# EAGLE design isolator (EAGLE 5.11)
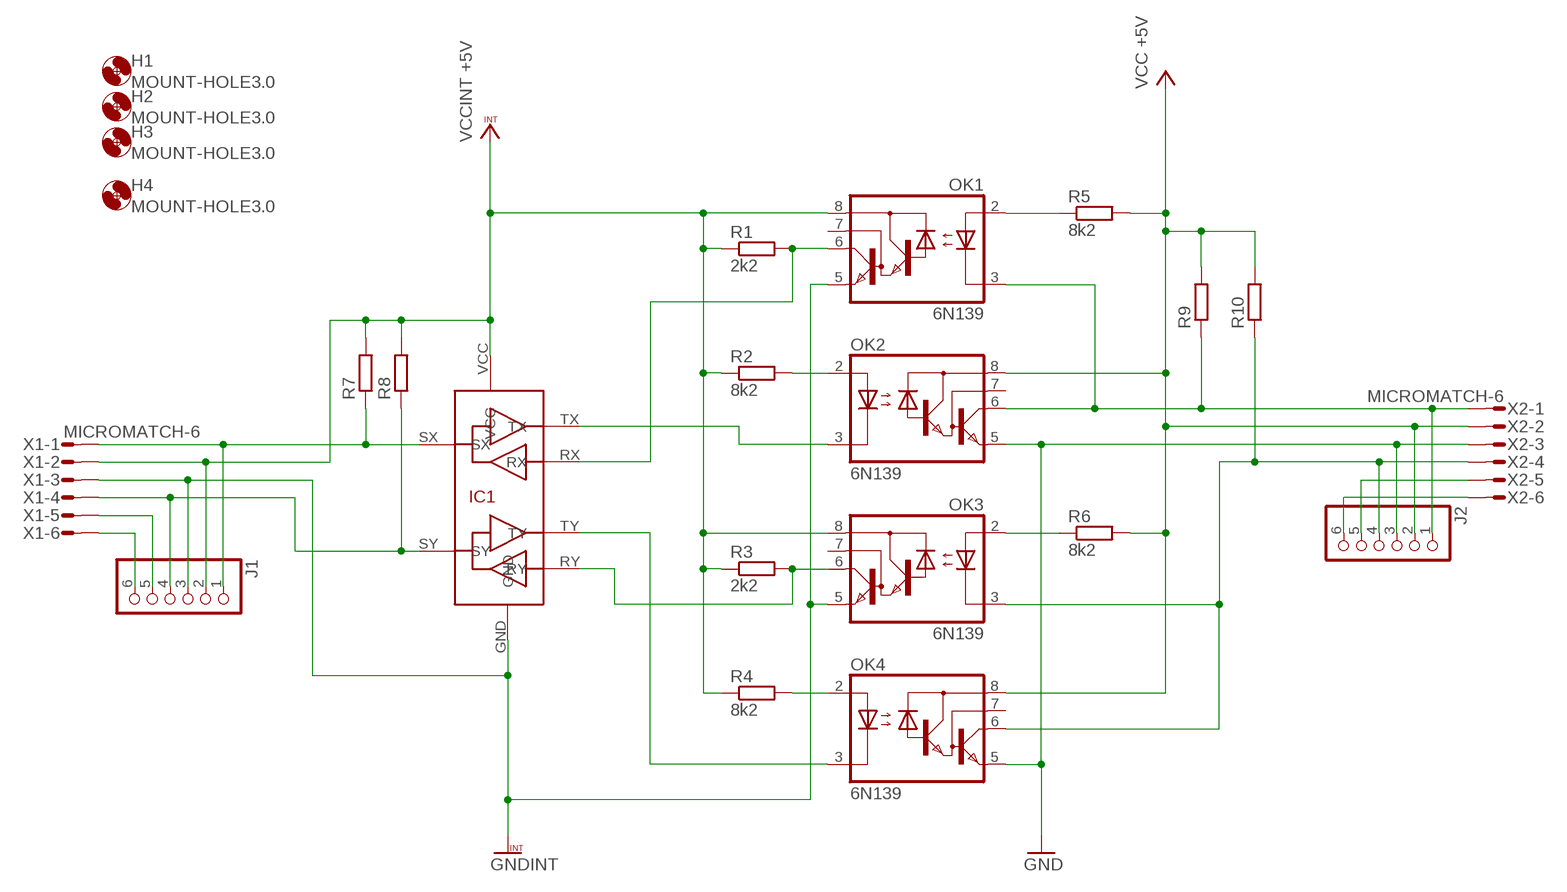
[diagram p0: schematic, sheet 1]

## Parts
H1  MOUNT-HOLE3.0  [3,0]
H2  MOUNT-HOLE3.0  [3,0]
H3  MOUNT-HOLE3.0  [3,0]
H4  MOUNT-HOLE3.0  [3,0]
IC1  P82B96  [DIL08]
J1  PINHD-1X6  [1X06]
J2  PINHD-1X6  [1X06]
OK1  6N139  [DIL08]
OK2  6N139  [DIL08]
OK3  6N139  [DIL08]
OK4  6N139  [DIL08]
R1  2k2  R-EU_0207/10  [0207/10]
R2  8k2  R-EU_0207/10  [0207/10]
R3  2k2  R-EU_0207/10  [0207/10]
R4  8k2  R-EU_0207/10  [0207/10]
R5  8k2  R-EU_0207/10  [0207/10]
R6  8k2  R-EU_0207/10  [0207/10]
R7  R-EU_0207/10  [0207/10]
R8  R-EU_0207/10  [0207/10]
R9  R-EU_0207/10  [0207/10]
R10  R-EU_0207/10  [0207/10]
X1  MICROMATCH-6  [MICROMATCH-6]
X2  MICROMATCH-6  [MICROMATCH-6]

## Nets
GND-EXT: J2.3 OK2.5(GND) OK4.5(GND) X2.3 ; supply symbol labelled GND
GND-INT: IC1.GND J1.3 OK1.5(GND) OK3.5(GND) X1.3 ; supply symbol labelled GNDINT
N$3: OK4.2(A) R4.2
N$5: OK2.2(A) R2.2
N$8: OK1.2(A) R5.1
N$9: OK3.2(A) R6.1
P1-EXT: J2.5 X2.5
P1-INT: J1.5 X1.5
P2-EXT: J2.6 X2.6
P2-INT: J1.6 X1.6
RX: IC1.RX OK1.6(VO) R1.2
RY: IC1.RY OK3.6(VO) R3.2
SCL-EXT: J2.4 OK3.3(C) OK4.6(VO) R10.1 X2.4
SCL-INT: IC1.SY J1.4 R8.1 X1.4
SDA-EXT: J2.1 OK1.3(C) OK2.6(VO) R9.1 X2.1
SDA-INT: IC1.SX J1.1 R7.1 X1.1
TX: IC1.TX OK2.3(C)
TY: IC1.TY OK4.3(C)
VCC-EXT: J2.2 OK2.8(VCC) OK4.8(VCC) R5.2 R6.2 R9.2 R10.2 X2.2 ; supply symbol labelled VCC +5V
VCC-INT: IC1.VCC J1.2 OK1.8(VCC) OK3.8(VCC) R1.1 R2.1 R3.1 R4.1 R7.2 R8.2 X1.2 ; supply symbol labelled VCCINT +5V
Unconnected: OK1.7(VB) OK2.7(VB) OK3.7(VB) OK4.7(VB)

## Library data of the parts
H1-H4 = holes:MOUNT-HOLE: MOUNTING HOLE with drill center marker
IC1 = scratch:P82B96: Dual In Line / Socket
J1 J2 = pinhead:PINHD-1X6: PIN HEADER
OK1-OK4 = optocoupler2:6N139: MOTOROLA OPTO COUPLER; MF: VISHAY/TELEFUNKEN; MPN: 6N138; OC_FARNELL: 9860150; OC_NEWARK: 35K5294
R1-R10 = resistor:R-EU_: RESISTOR, European symbol
X1 X2 = con-amp-micromatch:MICROMATCH-6: MicroMaTch 6 7-215464-6 / 0-215464-6 Drawing Number C-215464 DDEController.pdf; MPN: 7-215464-6; OC_FARNELL: 3784630; OC_NEWARK: 19R8125

## Board
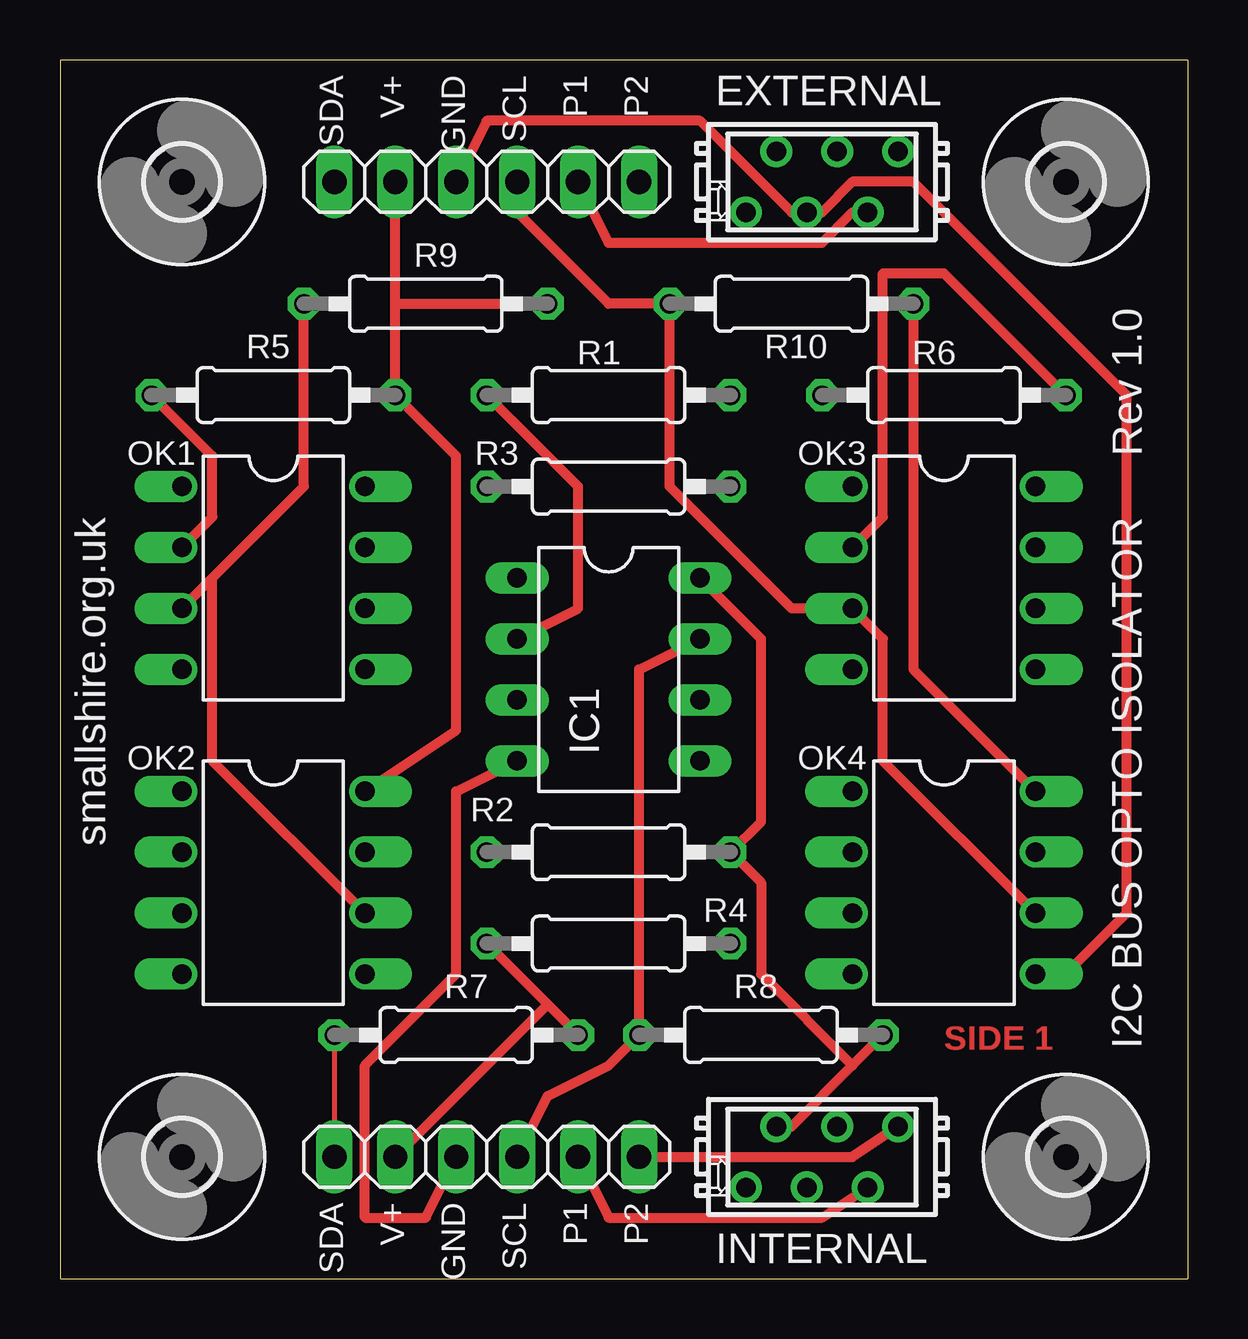
[diagram p1: board, top side]
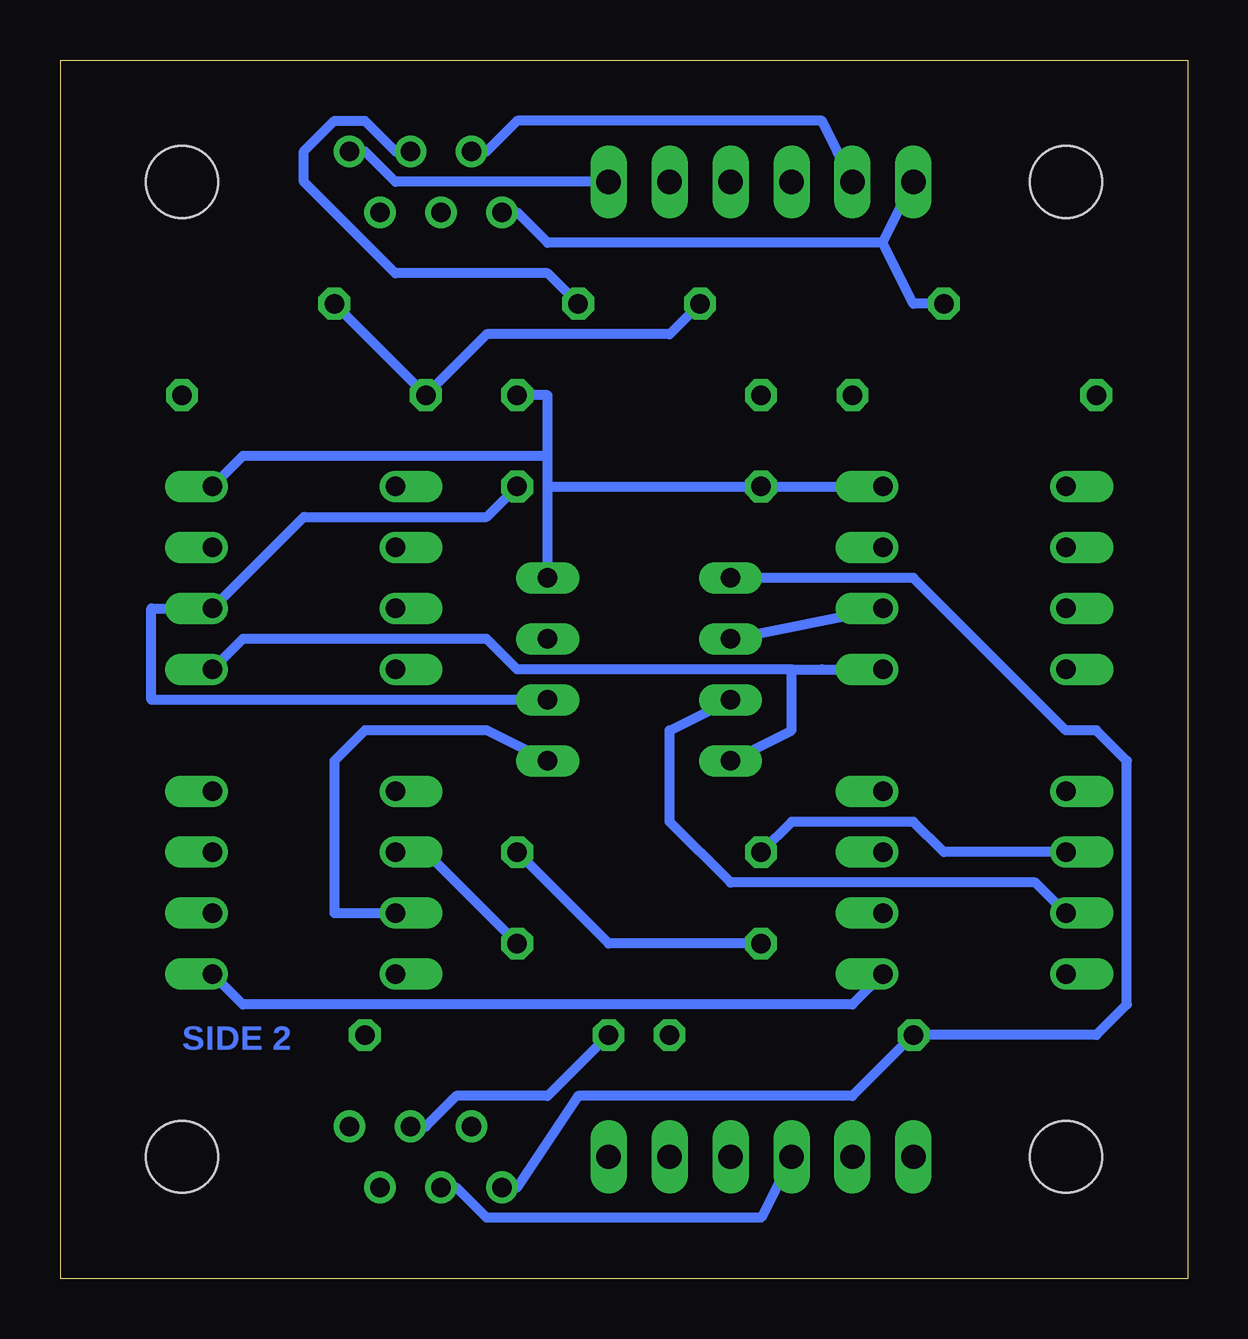
[diagram p2: board, bottom side, seen from below]

Size 46.99 x 50.8 mm. Coordinates in mm from the lower left corner, seen from the top.
Outline: 0,0 46.99,0 46.99,50.8 0,50.79 0,0
Copper layers 1*16: Top 0.035mm / dielectric 1.5mm / Bottom 0.035mm
Design rules "pcbtrain *": minimum track width 0.2mm, minimum drill 0.4mm, track to track 0.2mm, track to pad 0.2mm, pad to pad 0.2mm, via to via 0.2mm, smd to smd 0mil, copper to edge 10mil, drill to drill 0.2mm, minimum pad ring 10mil, minimum via ring 10mil, stop-mask expansion 0.125mm, vias tented up to drill 0mil, thermal gap 10mil

### Footprints (pad centres in the part's own frame; a part is rotated, then mirrored left to right if it is on the bottom)
3,0 = hole 3: 0,0
DIL08 = drill 0.813 long: GND 3.81,-3.81; RX -1.27,-3.81; RY 1.27,3.81; SX -3.81,-3.81; SY -1.27,3.81; TX 1.27,-3.81; TY 3.81,3.81; VCC -3.81,3.81
1X06 = drill 1.016 long: 1 -6.35,0; 2 -3.81,0; 3 -1.27,0; 4 1.27,0; 5 3.81,0; 6 6.35,0
DIL08' = drill 0.813 offset: 1 -3.81,-3.81; 2 -1.27,-3.81; 3 1.27,-3.81; 4 3.81,-3.81; 5 3.81,3.81; 6 1.27,3.81; 7 -1.27,3.81; 8 -3.81,3.81
0207/10 = drill 0.813 octagon: 1 -5.08,0; 2 5.08,0
MICROMATCH-6 = drill 0.813 round: 1 3.175,1.27; 2 1.905,-1.27; 3 0.635,1.27; 4 -0.635,-1.27; 5 -1.905,1.27; 6 -3.175,-1.27

### Placement (x,y rotation side)
H1  5.08,5.08 0 top
H2  5.08,45.72 0 top
H3  41.91,5.08 0 top
H4  41.91,45.72 0 top
IC1  22.86,25.4 270 top
J1  17.78,5.08 0 top
J2  17.78,45.72 0 top
OK1  6N139  [DIL08']  8.89,29.21 270 top
OK2  6N139  [DIL08']  8.89,16.51 270 top
OK3  6N139  [DIL08']  36.83,29.21 270 top
OK4  6N139  [DIL08']  36.83,16.51 270 top
R1  22.86,36.83 180 top
R2  22.86,17.78 180 top
R3  22.86,33.02 0 top
R4  22.86,13.97 0 top
R5  8.89,36.83 0 top
R6  36.83,36.83 180 top
R7  16.51,10.16 0 top
R8  29.21,10.16 0 top
R9  15.24,40.64 0 top
R10  30.48,40.64 0 top
X1  31.75,5.08 180 top
X2  31.75,45.72 180 top

### Tracks (layer width: path | path; a pad name or v marks a point on that pad's centre or on a via)
GND-EXT
  Top 0.406: J2.3 17.78,48.26 26.67,48.26 30.48,44.45 X2.3 31.75,44.45 33.02,45.72 35.56,45.72 44.45,36.83 44.45,15.24 41.91,12.7 OK4.5
  Bottom 0.406: OK2.5 13.97,11.43 39.37,11.43 OK4.5
GND-INT
  Top 0.406: J1.3 15.24,2.54 12.7,2.54 12.7,8.89 16.51,12.7 16.51,20.32 IC1.GND
  Bottom 0.406: J1.3 17.78,2.54 29.21,2.54 30.48,3.81 X1.3 | IC1.GND 16.51,22.86 16.51,25.4 | 16.51,25.4 15.24,25.4 OK1.5 | OK3.5 39.37,26.67 29.21,26.67 27.94,25.4 16.51,25.4
N$3
  Bottom 0.2: 31.75,17.78 OK4.2
  Bottom 0.406: R4.2 31.75,17.78
N$5
  Bottom 0.406: OK2.2 10.16,17.78 11.43,19.05 16.51,19.05 R2.2
N$8
  Top 0.406: OK1.2 6.35,31.75 6.35,34.29 R5.1
N$9
  Top 0.406: OK3.2 34.29,31.75 34.29,41.91 36.83,41.91 R6.1
P1-EXT
  Top 0.406: J2.5 22.86,43.18 31.75,43.18 33.02,44.45 X2.5
P1-INT
  Top 0.406: J1.5 22.86,2.54 31.75,2.54 X1.5
P2-EXT
  Bottom 0.2: 34.29,46.99 X2.6
  Bottom 0.406: 34.29,46.99 33.02,45.72 J2.6
P2-INT
  Top 0.406: J1.6 33.02,5.08 X1.6
RX
  Top 0.406: R1.2 21.59,33.02 21.59,27.94 IC1.RX
  Bottom 0.406: IC1.RX OK1.6
RY
  Bottom 0.406: IC1.RY 43.18,24.13 43.18,27.94 OK3.6 36.83,31.75 29.21,31.75 R3.2
SCL-EXT
  Top 0.406: OK4.6 34.29,21.59 34.29,26.67 OK3.3 30.48,27.94 25.4,33.02 R10.1 22.86,40.64 19.05,44.45 J2.4
  Bottom 0.406: R10.1 26.67,41.91 33.02,41.91 36.83,45.72 36.83,46.99 35.56,48.26 34.29,48.26 33.02,46.99 X2.4
SCL-INT
  Top 0.406: IC1.SY 24.13,25.4 R8.1 22.86,8.89 20.32,7.62 J1.4
  Bottom 0.406: R8.1 26.67,7.62 30.48,7.62 31.75,6.35 X1.4
SDA-EXT
  Top 0.406: 6.35,29.21 10.16,33.02 R9.1 | 6.35,29.21 OK1.3 | OK2.6 6.35,21.59 6.35,29.21
  Bottom 0.406: 12.7,43.18 26.67,43.18 27.94,44.45 X2.1 | 12.7,43.18 J2.1 | 12.7,43.18 11.43,40.64 R9.1
SDA-INT
  Top 0.2: R7.1 J1.1
  Bottom 0.406: X1.1 27.94,3.81 25.4,7.62 13.97,7.62 R7.1 3.81,10.16 2.54,11.43 2.54,21.59 3.81,22.86 5.08,22.86 11.43,29.21 IC1.SX
TX
  Bottom 0.406: OK2.3 6.35,16.51 19.05,16.51 21.59,19.05 21.59,22.86 IC1.TX
TY
  Bottom 0.406: IC1.TY 29.21,22.86 34.29,22.86 35.56,21.59 35.56,15.24 OK4.3
VCC-EXT
  Top 0.406: OK4.8 35.56,25.4 R10.2 | OK2.8 16.51,22.86 16.51,34.29 R5.2 13.97,40.64 | 13.97,40.64 R9.2 | 13.97,40.64 J2.2
  Bottom 0.406: R10.2 R6.2 29.21,39.37 21.59,39.37 R9.2 | J2.2 15.24,48.26 27.94,48.26 29.21,46.99 X2.2
VCC-INT
  Top 0.406: 33.02,8.89 R8.2 | 33.02,8.89 30.48,6.35 X1.2 | 20.32,11.43 R4.1 | 20.32,11.43 R7.2 | J1.2 20.32,11.43 | 33.02,8.89 29.21,12.7 29.21,16.51 R2.1 29.21,19.05 29.21,26.67 IC1.VCC
  Bottom 0.406: R2.1 24.13,13.97 R4.1 | OK1.8 R3.1 26.67,33.02 | 26.67,34.29 26.67,36.83 R1.1 | 26.67,33.02 26.67,34.29 | IC1.VCC 26.67,33.02 | OK3.8 39.37,34.29 26.67,34.29

### Text on the board
Top: SIDE 1
Bottom: SIDE 2
tPlace: SDA | V+ | GND | SCL | P1 | P2 | EXTERNAL | Rev 1.0 | smallshire.org.uk | I2C BUS OPTO ISOLATOR | SDA | V+ | GND | SCL | P1 | P2 | INTERNAL
tValues: P92B96